# EAGLE design vu (EAGLE 6.6.0)
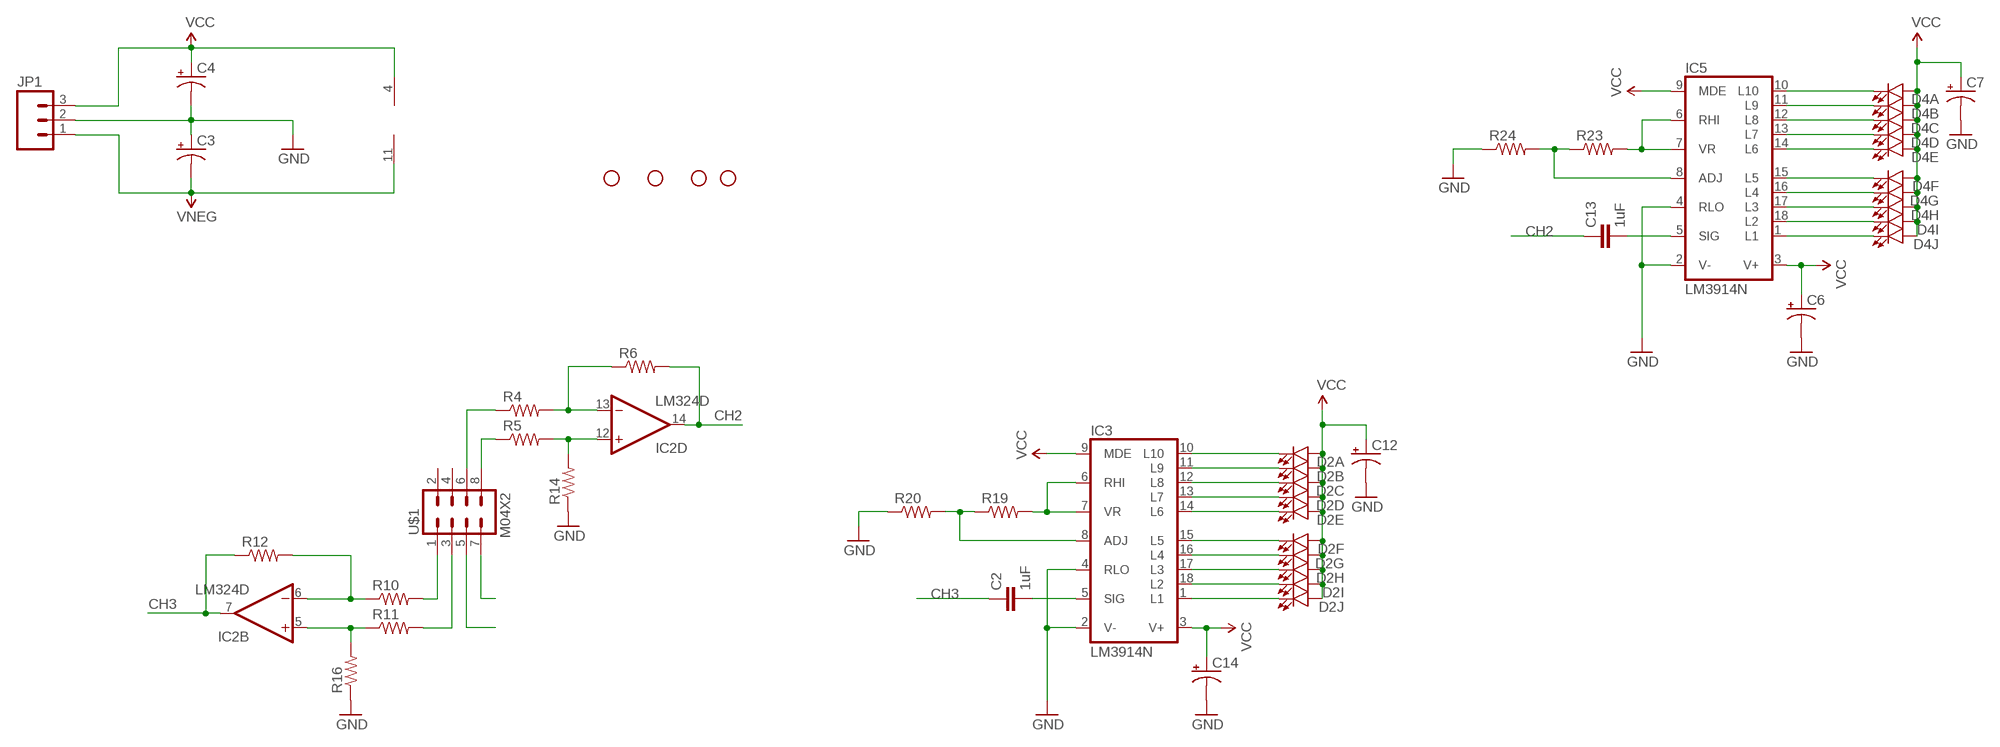
[diagram p0: schematic, sheet 1]

## Parts
C2  1uF  CAP1206  [1206]
C3  CAP_POLPTH1  [CPOL-RADIAL-100UF-25V]
C4  CAP_POLPTH1  [CPOL-RADIAL-100UF-25V]
C6  CAP_POL1206  [EIA3216]
C7  CAP_POL1206  [EIA3216]
C12  CAP_POL1206  [EIA3216]
C13  1uF  CAP1206  [1206]
C14  CAP_POL1206  [EIA3216]
D2  LED_BARGRAPH_10  [LED_BARGAPH_10]
D4  LED_BARGRAPH_10  [LED_BARGAPH_10]
IC2  LM324D  [SO14]
IC3  LM3914N  [DIL18]
IC5  LM3914N  [DIL18]
JP1  M03POLAR  [MOLEX-1X3]
R4  RESISTOR0603  [0603-RES]
R5  RESISTOR0603  [0603-RES]
R6  RESISTOR0603  [0603-RES]
R10  RESISTOR0603  [0603-RES]
R11  RESISTOR0603  [0603-RES]
R12  RESISTOR0603  [0603-RES]
R14  RESISTOR0603  [0603-RES]
R16  RESISTOR0603  [0603-RES]
R19  RESISTOR1206  [1206]
R20  RESISTOR1206  [1206]
R23  RESISTOR1206  [1206]
R24  RESISTOR1206  [1206]
STANDOFF1  STAND-OFF  [STAND-OFF]
STANDOFF2  STAND-OFF  [STAND-OFF]
STANDOFF3  STAND-OFF  [STAND-OFF]
STANDOFF4  STAND-OFF  [STAND-OFF]
U$1  M04X2  [2X4]

## Nets
CH2: C13.1 IC2.14(D:OUT) R6.2
CH3: C2.1 IC2.7(B:OUT) R12.1
GND: C3.1(+) C4.2(-) C6.C(-) C7.C(-) C12.C(-) C14.C(-) IC3.2(V-) IC3.4(RLO) IC5.2(V-) IC5.4(RLO) JP1.2 R14.1 R16.1 R20.1 R24.1
N$1: R11.2 U$1.3
N$2: U$1.5
N$3: U$1.7
N$4: R10.2 U$1.1
N$5: IC2.12(D:+IN) R5.2 R14.2
N$6: R4.1 U$1.6
N$11: IC2.6(B:-IN) R10.1 R12.2
N$12: IC2.5(B:+IN) R11.1 R16.2
N$15: R5.1 U$1.8
N$16: IC2.13(D:-IN) R4.2 R6.1
N$30: D2.19(B:C) IC3.11(L9)
N$31: D2.18(C:C) IC3.12(L8)
N$32: D2.17(D:C) IC3.13(L7)
N$33: D2.16(E:C) IC3.14(L6)
N$34: D2.15(F:C) IC3.15(L5)
N$35: D2.14(G:C) IC3.16(L4)
N$36: D2.13(H:C) IC3.17(L3)
N$37: D2.12(I:C) IC3.18(L2)
N$38: D2.11(J:C) IC3.1(L1)
N$39: D2.20(A:C) IC3.10(L10)
N$40: C2.2 IC3.5(SIG)
N$41: IC3.6(RHI) IC3.7(VR) R19.2
N$42: IC3.8(ADJ) R19.1 R20.2
N$56: D4.19(B:C) IC5.11(L9)
N$57: D4.18(C:C) IC5.12(L8)
N$58: D4.17(D:C) IC5.13(L7)
N$59: D4.16(E:C) IC5.14(L6)
N$60: D4.15(F:C) IC5.15(L5)
N$61: D4.14(G:C) IC5.16(L4)
N$62: D4.13(H:C) IC5.17(L3)
N$63: D4.12(I:C) IC5.18(L2)
N$64: D4.11(J:C) IC5.1(L1)
N$65: D4.20(A:C) IC5.10(L10)
N$66: C13.2 IC5.5(SIG)
N$67: IC5.6(RHI) IC5.7(VR) R23.2
N$68: IC5.8(ADJ) R23.1 R24.2
VCC: C4.1(+) C6.A(+) C7.A(+) C12.A(+) C14.A(+) D2.1(A:A) D2.2(B:A) D2.3(C:A) D2.4(D:A) D2.5(E:A) D2.6(F:A) D2.7(G:A) D2.8(H:A) D2.9(I:A) D2.10(J:A) D4.1(A:A) D4.2(B:A) D4.3(C:A) D4.4(D:A) D4.5(E:A) D4.6(F:A) D4.7(G:A) D4.8(H:A) D4.9(I:A) D4.10(J:A) IC2.4(P:V+) IC3.3(V+) IC3.9(MDE) IC5.3(V+) IC5.9(MDE) JP1.3
VNEG: C3.2(-) IC2.11(P:V-) JP1.1
Unconnected: IC2.1(A:OUT) IC2.2(A:-IN) IC2.3(A:+IN) IC2.8(C:OUT) IC2.9(C:-IN) IC2.10(C:+IN) U$1.2 U$1.4

## Library data of the parts
C2 C13 = 1_SparkFun-Capacitors:CAP: Capacitor Standard 0603 ceramic capacitor, and 0.1" leaded capacitor.
C3 C4 C6 C7 C12 C14 = 1_SparkFun-Capacitors:CAP_POL: Capacitor Polarized These are standard SMD and PTH capacitors. Normally 10uF, 47uF, and 100uF in electrolytic and tantalum varieties. Always verify the external diameter of the through hole cap, it varies with capacity, voltage, and manufacturer. The EIA devices should be standard.
D2 D4 = 1_SparkFun-LED:LED_BARGRAPH_10: 10-Segment LED Bar Graph SFE part numbers: COM-09935 (red, Vf = 2.1V, Ifmax = 20mA) COM-09936 (yellow, Vf = 2.1V, Ifmax = 20mA) COM-09937 (blue, Vf = 3.4V, Ifmax = 20mA) COM-09938 (green, Vf = 3.4V, Ifmax = 20mA)
IC2 = linear:LM324: OP AMP
IC3 IC5 = linear:LM3914N: LED DRIVER senses analog voltage levels and drives 10 LEDs
JP1 = 1_SparkFun-Connectors:M03: Header 3 Standard 3-pin 0.1" header. Use with straight break away headers (SKU : PRT-00116), right angle break away headers (PRT-00553), swiss pins (PRT-00743), machine pins (PRT-00117), and female headers (PRT-00115). Molex polarized connector foot print use with SKU : PRT-08232 with associated crimp pins and housings.
R4-R6 R10-R12 R14 R16 R19 R20 R23 R24 = 1_SparkFun-Resistors:RESISTOR: Resistor Basic schematic elements and footprints for 0603, 1206, and PTH resistors.
STANDOFF1-STANDOFF4 = 1_SparkFun-Electromechanical:STAND-OFF: #4 Stand Off This is the mechanical footprint for a #4 phillips button head screw. Use the keepout ring to avoid running the screw head into surrounding components. SKU : PRT-00447
U$1 = 1_SparkFun-Connectors:M04X2: .1" header, two rows of four.

## Board
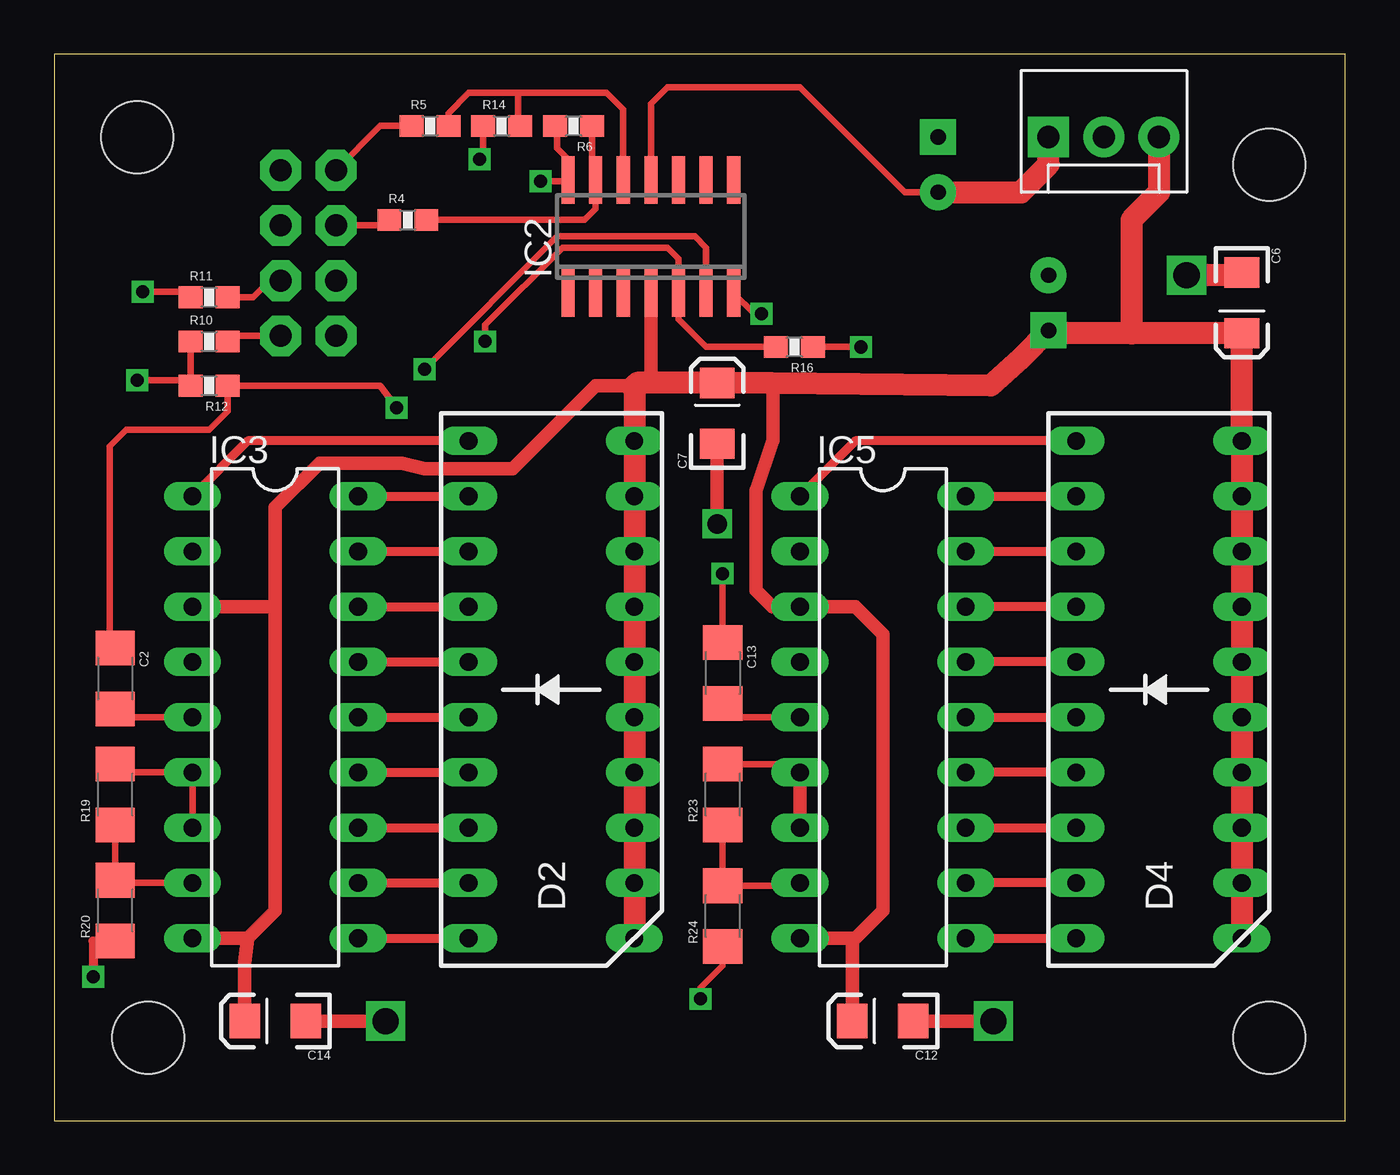
[diagram p1: board, top side]
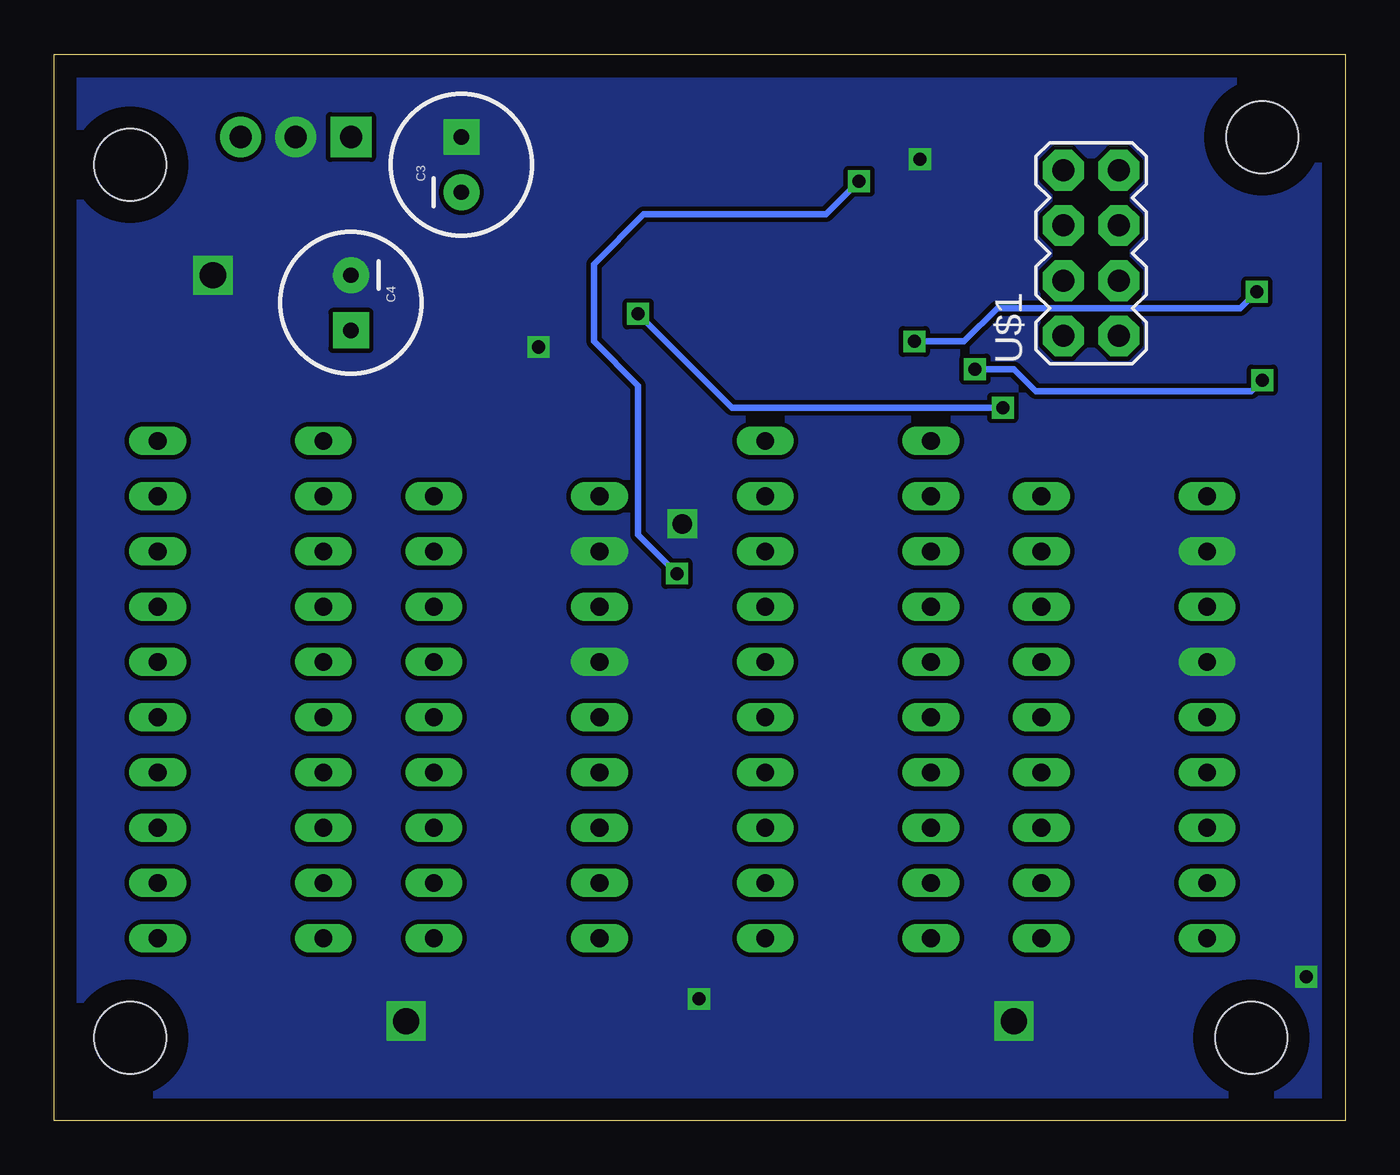
[diagram p2: board, bottom side, seen from below]

Size 59.36 x 49.01 mm. Coordinates in mm from the lower left corner, seen from the top.
Outline: 0,0 59.36,0 59.36,49.01 0,49.01 0,0
Copper layers (1*16): Top 0.035mm / dielectric 1.5mm / Bottom 0.035mm
Design rules "default": minimum track width 10mil, minimum drill 24mil, track to track 8mil, track to pad 8mil, pad to pad 8mil, via to via 8mil, smd to smd 8mil, copper to edge 40mil, drill to drill 8mil, minimum pad ring 10mil, minimum via ring 8mil, stop-mask expansion 4mil, vias tented up to drill 0mil, thermal gap 10mil

### Footprints (pad centres in the part's own frame; a part is rotated, then mirrored left to right if it is on the bottom)
1206 = smd 1.6 x 1.8: 1 -1.4,0; 2 1.4,0
CPOL-RADIAL-100UF-25V = drill 0.7 pad 1.651 square: 1 1.27,0 | drill 0.7 pad 1.651: 2 -1.27,0
EIA3216 = smd 1.4 x 1.6: A 1.4,0; C -1.4,0
LED_BARGAPH_10 = drill 0.813 long: 1 -11.43,-3.81; 2 -8.89,-3.81; 3 -6.35,-3.81; 4 -3.81,-3.81; 5 -1.27,-3.81; 6 1.27,-3.81; 7 3.81,-3.81; 8 6.35,-3.81; 9 8.89,-3.81; 10 11.43,-3.81; 11 11.43,3.81; 12 8.89,3.81; 13 6.35,3.81; 14 3.81,3.81; 15 1.27,3.81; 16 -1.27,3.81; 17 -3.81,3.81; 18 -6.35,3.81; 19 -8.89,3.81; 20 -11.43,3.81
SO14 = smd 0.6 x 2.2: 1 -3.81,-2.6; 2 -2.54,-2.6; 3 -1.27,-2.6; 4 0,-2.6; 5 1.27,-2.6; 6 2.54,-2.6; 7 3.81,-2.6; 8 3.81,2.6; 9 2.54,2.6; 10 1.27,2.6; 11 0,2.6; 12 -1.27,2.6; 13 -2.54,2.6; 14 -3.81,2.6
DIL18 = drill 0.813 long: 1 -10.16,-3.81; 2 -7.62,-3.81; 3 -5.08,-3.81; 4 -2.54,-3.81; 5 0,-3.81; 6 2.54,-3.81; 7 5.08,-3.81; 8 7.62,-3.81; 9 10.16,-3.81; 10 10.16,3.81; 11 7.62,3.81; 12 5.08,3.81; 13 2.54,3.81; 14 0,3.81; 15 -2.54,3.81; 16 -5.08,3.81; 17 -7.62,3.81; 18 -10.16,3.81
MOLEX-1X3 = drill 1.016 pad 1.88 square: 1 0,0 | drill 1.016 pad 1.88: 2 2.54,0; 3 5.08,0
0603-RES = smd 1.1 x 1: 1 -0.85,0; 2 0.85,0
STAND-OFF = hole 3.302: 0,0
2X4 = drill 1.016 pad 1.88 octagon: 1 -3.81,-1.27; 2 -3.81,1.27; 3 -1.27,-1.27; 4 -1.27,1.27; 5 1.27,-1.27; 6 1.27,1.27; 7 3.81,-1.27; 8 3.81,1.27

### Placement (x,y rotation side)
C2  2.79,20.32 270 top
C3  40.64,43.94 90 bottom
C4  45.72,37.59 270 bottom
C6  54.61,37.59 270 top
C7  30.48,32.51 90 top
C12  38.1,4.57 180 top
C13  30.73,20.57 270 top
C14  10.16,4.57 180 top
D2  22.86,19.81 90 top
D4  50.8,19.81 90 top
IC2  27.43,40.64 0 top
IC3  10.16,18.54 270 top
IC5  38.1,18.54 270 top
JP1  45.72,45.21 0 top
R4  16.26,41.4 0 top
R5  17.27,45.72 0 top
R6  23.88,45.72 180 top
R10  7.11,35.81 0 top
R11  7.11,37.85 0 top
R12  7.11,33.78 180 top
R14  20.57,45.72 0 top
R16  34.04,35.56 180 top
R19  2.79,14.99 90 top
R20  2.79,9.65 90 top
R23  30.73,14.99 90 top
R24  30.73,9.4 90 top
STANDOFF1  4.32,3.81 0 top
STANDOFF2  55.88,43.94 0 top
STANDOFF3  3.81,45.21 0 top
STANDOFF4  55.88,3.81 0 top
U$1  11.68,39.88 90 bottom

### Tracks (layer width: path | path; a pad name or v marks a point on that pad's centre or on a via)
CH2  (via drill 0.6)
  Top 0.305: R6.2 23.11,45.63 23.11,44.7 23.62,44.2 IC2.14 23.56,43.18 v22.35,43.18 | C13.1 v30.73,25.15
  Bottom 0.305: v30.73,25.15 32.51,26.92 32.51,33.78 34.54,35.81 34.54,39.37 32.26,41.66 23.88,41.66 v22.35,43.18
CH3  (via drill 0.6)
  Top 0.305: C2.1 2.54,21.97 2.54,30.99 3.3,31.75 7.11,31.75 7.96,32.6 R12.1 14.99,33.78 v15.75,32.77 | v32.51,37.08 32.2,37.08 IC2.7
  Bottom 0.305: v15.75,32.77 28.19,32.77 v32.51,37.08
GND  (via drill 0.6, 0.9, 1.2)
  Top 0.305: R24.1 30.73,7.11 29.72,6.1 v29.72,5.59 | R14.1 19.72,44.36 v19.56,44.2 | R16.1 v37.08,35.56
  Top 0.406: R20.1 1.78,8.25 v1.78,6.6
  Top 0.61: C12.C v43.18,4.57 | C14.C v15.24,4.57 | C7.C v30.48,27.43
  Top 1.016: C6.C 54.61,38.86 v52.07,38.86
  pour Bottom (no thermals): 1.27,0 58.42,0 58.42,47.75 1.27,47.75
N$1
  Top 0.305: U$1.3 9.91,38.61 9.14,37.85 R11.2
N$4
  Top 0.305: U$1.1 8.22,36.07 R10.2
N$5
  Top 0.305: R5.2 18.12,46.32 19.05,47.24 21.34,47.24 | 21.34,47.24 21.34,45.81 R14.2 | IC2.12 26.16,46.48 25.4,47.24 21.34,47.24
N$6
  Top 0.305: U$1.6 15.15,41.15 R4.1
N$11  (via drill 0.6)
  Top 0.305: R10.1 R12.2 6.01,34.04 v3.81,34.04 | IC2.6 29.97,40.13 29.46,40.64 23.11,40.64 v17.02,34.54
  Bottom 0.305: v17.02,34.54 15.24,34.54 14.22,33.53 4.32,33.53 v3.81,34.04
N$12  (via drill 0.6)
  Top 0.305: R16.2 29.97,35.56 28.7,36.83 IC2.5 28.7,39.62 28.19,40.13 23.37,40.13 19.81,36.58 v19.81,35.81 | v4.06,38.1 6.01,38.1 R11.1
  Bottom 0.305: v19.81,35.81 17.53,35.81 16,37.34 4.83,37.34 v4.06,38.1
N$15
  Top 0.305: R5.1 14.99,45.72 U$1.8
N$16
  Top 0.305: R6.1 24.73,43.41 IC2.13 24.89,41.91 24.38,41.4 R4.2
N$30
  Top 0.406: IC3.11 D2.19
N$31
  Top 0.406: IC3.12 D2.18
N$32
  Top 0.406: IC3.13 D2.17
N$33
  Top 0.406: IC3.14 D2.16
N$34
  Top 0.406: IC3.15 D2.15
N$35
  Top 0.406: IC3.16 D2.14
N$36
  Top 0.406: IC3.17 D2.13
N$37
  Top 0.406: IC3.18 D2.12
N$38
  Top 0.406: D2.11 8.89,31.24 IC3.1
N$39
  Top 0.406: IC3.10 D2.20
N$40
  Top 0.305: IC3.5 3.17,18.54 C2.2
N$41
  Top 0.305: R19.2 3.18,16 IC3.6 IC3.7
N$42
  Top 0.305: IC3.8 2.92,10.92 R20.2 R19.1
N$56
  Top 0.406: D4.19 IC5.11
N$57
  Top 0.406: IC5.12 D4.18
N$58
  Top 0.406: D4.17 IC5.13
N$59
  Top 0.406: IC5.14 D4.16
N$60
  Top 0.406: D4.15 IC5.15
N$61
  Top 0.406: D4.14 IC5.16
N$62
  Top 0.406: IC5.17 D4.13
N$63
  Top 0.406: IC5.18 D4.12
N$64
  Top 0.406: D4.11 36.83,31.24 IC5.1
N$65
  Top 0.406: IC5.10 D4.20
N$66
  Top 0.305: IC5.5 31.37,18.54 C13.2
N$67
  Top 0.305: R23.2 33.91,16.39 IC5.6
  Top 0.61: IC5.6 IC5.7
N$68
  Top 0.305: IC5.8 34.17,10.8 R24.2 R23.1
VCC
  Top 0.61: IC5.9 36.83,8.38 | 36.83,8.38 38.1,9.65 38.1,22.35 36.83,23.62 IC5.3 33.02,23.62 32.26,24.38 32.26,28.96 33.05,31.27 33.05,33.88 | C12.A 36.7,8.25 36.83,8.38 | C14.A 8.76,7.24 8.89,8.38 | IC3.9 8.89,8.38 | 8.89,8.38 10.16,9.65 10.16,23.62 | 10.16,23.62 IC3.3 | IC2.4 27.43,34.04 26.67,33.78 | 10.16,23.62 10.16,28.19 12.19,30.23 16,30.23 17.02,29.97 21.08,29.97 24.89,33.78 26.42,33.78 26.67,33.53
  Top 1.016: D4.1 D4.2 D4.3 D4.4 D4.5 D4.6 D4.7 D4.8 D4.9 D4.10 C6.A 49.53,36.19 | 26.8,31.37 D2.10 | D2.10 D2.9 D2.8 D2.7 D2.6 D2.5 D2.4 D2.3 D2.2 D2.1 | 49.53,36.19 45.85,36.19 C4.1 44.45,35.05 43.05,33.78 33.05,33.88 C7.A 26.8,33.91 26.67,33.78 26.67,33.53 D2.10 | JP1.3 50.8,42.67 49.53,41.4 49.53,36.19
VNEG
  Top 0.305: C3.2 39.12,42.67 34.29,47.5 28.19,47.5 27.43,46.74 IC2.11
  Top 1.016: C3.2 44.45,42.67 45.72,43.94 JP1.1